# EAGLE schematic DarkRoom (EAGLE 8.2.2)
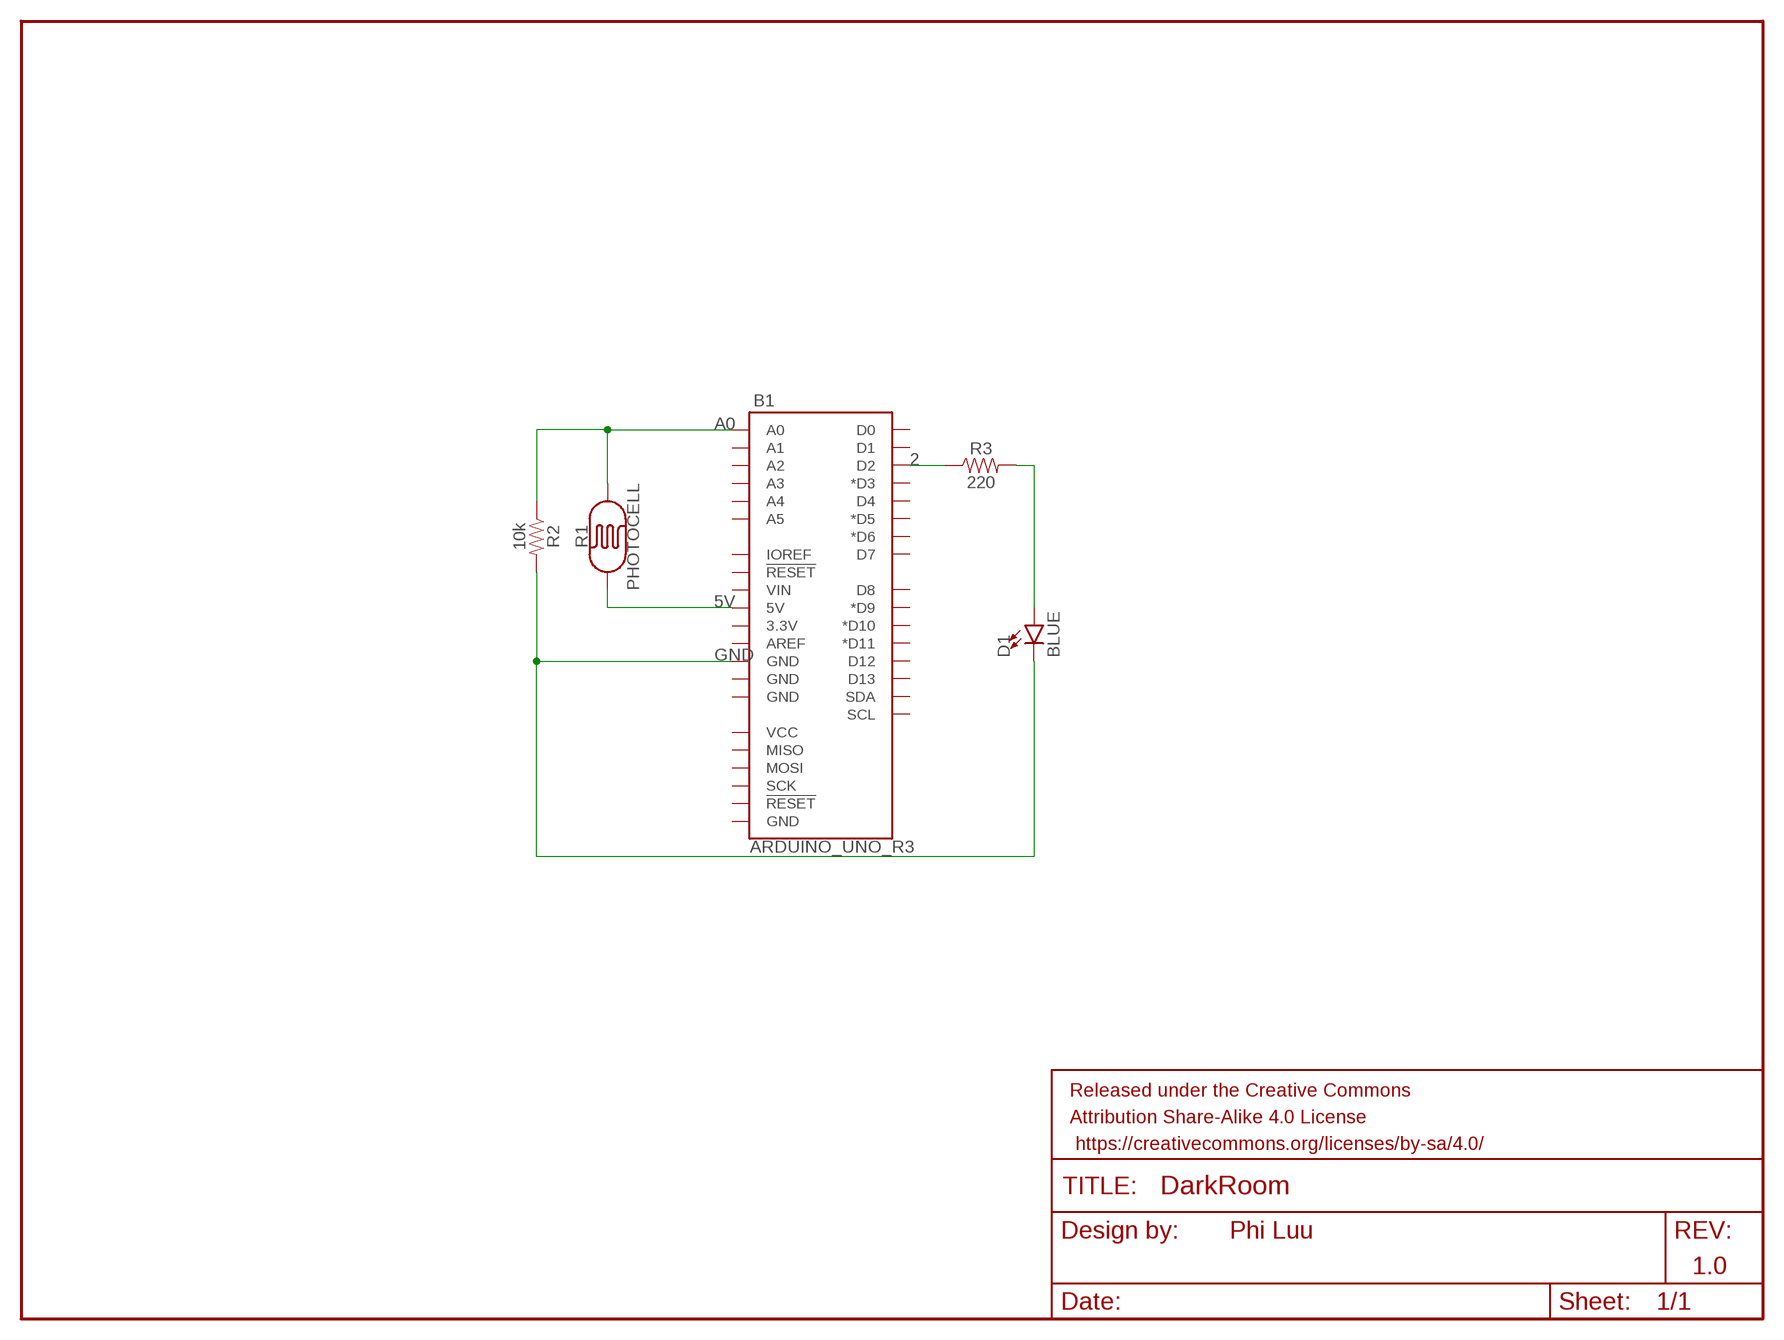
[diagram p0: schematic, sheet 1]

## Parts
B1  ARDUINO_UNO_R3  [ARDUINO_R3]
D1  BLUE  LED5MM  [LED_5MM]
FRAME1  FRAME-LETTER  [CREATIVE_COMMONS]
R1  PHOTOCELL  PHOTOCELLPTH  [PHOTOCELL]
R2  10k  10KOHM-HORIZ-1/4W-5%  [AXIAL-0.3]
R3  220  10KOHM-HORIZ-1/4W-5%  [AXIAL-0.3]

## Nets
2: B1.D2 R3.P$1
5V: B1.5V R1.1
A0: B1.A0 R1.2 R2.P$1
GND: B1.GND@4(GND) D1.K(C) R2.P$2
LED: D1.A R3.P$2
Unconnected: B1.3.3V B1.A1 B1.A2 B1.A3 B1.A4 B1.A5 B1.AREF B1.D0 B1.D1 B1.D3(*D3) B1.D4 B1.D5(*D5) B1.D6(*D6) B1.D7 B1.D8 B1.D9(*D9) B1.D10(*D10) B1.D11(*D11) B1.D12 B1.D13 B1.GND@1(GND) B1.GND@2(GND) B1.GND@3(GND) B1.IOREF B1.MISO B1.MOSI B1.RESET@1(!RESET!) B1.RESET@2(!RESET!) B1.SCK B1.SCL B1.SDA B1.VCC B1.VIN

## Notes on the sheet
- Phi Luu
- 1.0

## Library data of the parts
B1 = SparkFun-Boards:ARDUINO_UNO_R3: Arduino R3 Footprint with SPI header Arduino Uno R3 Compatible Footprint. Matches PCB size of the original board. SparkFun Products: SAMD21 Dev Breakout <https://www.sparkfun.com/products/13672> RedBoard <https://www.sparkfun.com/products/12757> R3 Stackable Headers <https://www.sparkfun.com/products/11417>
D1 = SparkFun-LED:LED: LED (Generic) Standard schematic elements and footprints for 5mm, 3mm, 1206, and 0603 sized LEDs. Generic LEDs with no color specified.
FRAME1 = SparkFun-Aesthetics:FRAME-LETTER: Schematic Frame - Letter Standard 8.5x11 US Letter frame
R1 = SparkFun-Sensors:PHOTOCELL: Photocell (Photodetector, Photo Resistor, CdS) This is a very small light sensor. A photocell changes (also called a photodetector, photo resistor, CdS or photoconductive cell) resistance depending on the amount of light it is exposed to. These little sensors make great ambient light triggers (when light in the room turns on, do something). Datasheet <http://cdn.sparkfun.com/datasheets/Sensors/LightImaging/SEN-09088.pdf> SparkFun Products Mini Photocell <https://www.sparkfun.com/products/9088> (SEN-09088); PROD_ID: COMP-09129; SF_ID: SEN-09088
R2 = SparkFun-Resistors:10KOHM: 10kΩ resistor A resistor is a passive two-terminal electrical component that implements electrical resistance as a circuit element. Resistors act to reduce current flow, and, at the same time, act to lower voltage levels within circuits. - Wikipedia; PROD_ID: RES-09435
R3 = SparkFun-Resistors:10KOHM: 10kΩ resistor A resistor is a passive two-terminal electrical component that implements electrical resistance as a circuit element. Resistors act to reduce current flow, and, at the same time, act to lower voltage levels within circuits. - Wikipedia; PROD_ID: RES-09435; VALUE: 10k